# EAGLE design denziben (EAGLE 9.6.2)
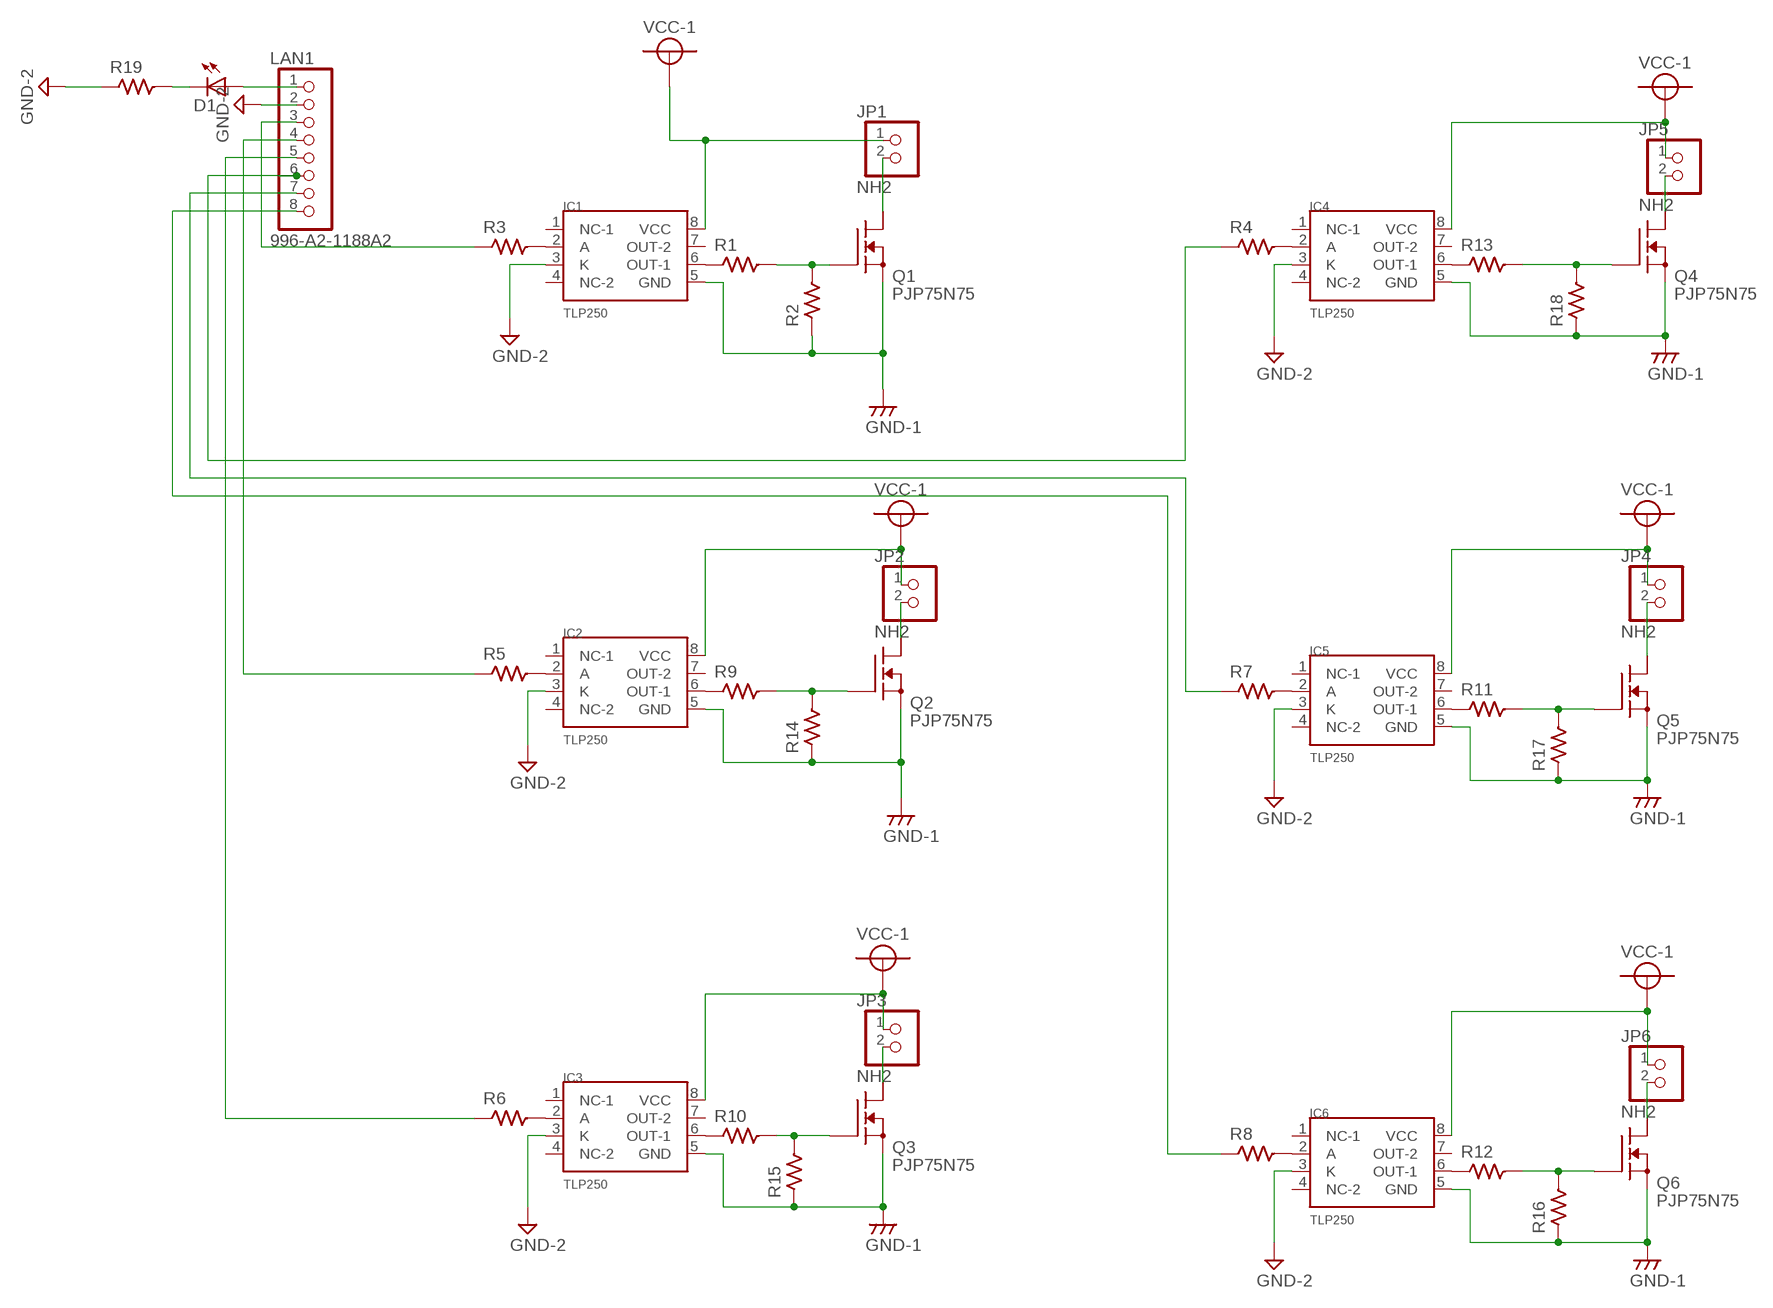
[diagram p0: schematic, sheet 1]

## Parts
D1  LED""  [LED5MM]
IC1  TLP250  [DIL8]
IC2  TLP250  [DIL8]
IC3  TLP250  [DIL8]
IC4  TLP250  [DIL8]
IC5  TLP250  [DIL8]
IC6  TLP250  [DIL8]
JP1  NH2  [NH2]
JP2  NH2  [NH2]
JP3  NH2  [NH2]
JP4  NH2  [NH2]
JP5  NH2  [NH2]
JP6  NH2  [NH2]
LAN1  996-A2-1188A2  [996-A2-1188A2]
Q1  PJP75N75  [TO220]
Q2  PJP75N75  [TO220]
Q3  PJP75N75  [TO220]
Q4  PJP75N75  [TO220]
Q5  PJP75N75  [TO220]
Q6  PJP75N75  [TO220]
R1  R1/4W  [R:1/4W]
R2  R1/4W  [R:1/4W]
R3  R1/4W  [R:1/4W]
R4  R1/4W  [R:1/4W]
R5  R1/4W  [R:1/4W]
R6  R1/4W  [R:1/4W]
R7  R1/4W  [R:1/4W]
R8  R1/4W  [R:1/4W]
R9  R1/4W  [R:1/4W]
R10  R1/4W  [R:1/4W]
R11  R1/4W  [R:1/4W]
R12  R1/4W  [R:1/4W]
R13  R1/4W  [R:1/4W]
R14  R1/4W  [R:1/4W]
R15  R1/4W  [R:1/4W]
R16  R1/4W  [R:1/4W]
R17  R1/4W  [R:1/4W]
R18  R1/4W  [R:1/4W]
R19  R1/4W  [R:1/4W]

## Nets
GND: IC1.5(GND) IC2.5(GND) IC3.5(GND) IC4.5(GND) IC5.5(GND) IC6.5(GND) Q1.3(NｃｈS) Q2.3(NｃｈS) Q3.3(NｃｈS) Q4.3(NｃｈS) Q5.3(NｃｈS) Q6.3(NｃｈS) R2.P$1 R14.P$1 R15.P$1 R16.P$1 R17.P$1 R18.P$1 ; supply symbol labelled GND-1
GND-2: IC1.3(K) IC2.3(K) IC3.3(K) IC4.3(K) IC5.3(K) IC6.3(K) LAN1.2 R19.P$1
N$1: JP1.2 Q1.2(NｃｈD)
N$2: Q1.1(Nｃｈ-G) R1.P$2 R2.P$2
N$3: IC4.2(A) R4.P$2
N$4: IC1.6(OUT-1) R1.P$1
N$5: IC2.2(A) R5.P$2
N$6: IC3.2(A) R6.P$2
N$7: IC1.2(A) R3.P$2
N$8: IC6.2(A) R8.P$2
N$9: IC2.6(OUT-1) R9.P$1
N$10: IC3.6(OUT-1) R10.P$1
N$11: IC5.6(OUT-1) R11.P$1
N$12: IC6.6(OUT-1) R12.P$1
N$13: IC4.6(OUT-1) R13.P$1
N$14: Q3.1(Nｃｈ-G) R10.P$2 R15.P$2
N$15: Q6.1(Nｃｈ-G) R12.P$2 R16.P$2
N$16: Q5.1(Nｃｈ-G) R11.P$2 R17.P$2
N$17: Q4.1(Nｃｈ-G) R13.P$2 R18.P$2
N$18: Q2.1(Nｃｈ-G) R9.P$2 R14.P$2
N$19: LAN1.3 R3.P$1
N$20: JP2.2 Q2.2(NｃｈD)
N$21: LAN1.4 R5.P$1
N$22: LAN1.5 R6.P$1
N$23: JP3.2 Q3.2(NｃｈD)
N$24: LAN1.6 R4.P$1
N$25: LAN1.7 R7.P$1
N$26: JP5.2 Q4.2(NｃｈD)
N$27: LAN1.8 R8.P$1
N$28: IC5.2(A) R7.P$2
N$29: JP4.2 Q5.2(NｃｈD)
N$30: JP6.2 Q6.2(NｃｈD)
N$31: D1.A LAN1.1
N$32: D1.K(C) R19.P$2
VCC-1: IC1.8(VCC) IC2.8(VCC) IC3.8(VCC) IC4.8(VCC) IC5.8(VCC) IC6.8(VCC) JP1.1 JP2.1 JP3.1 JP4.1 JP5.1 JP6.1
Unconnected: IC1.1(NC-1) IC1.4(NC-2) IC1.7(OUT-2) IC2.1(NC-1) IC2.4(NC-2) IC2.7(OUT-2) IC3.1(NC-1) IC3.4(NC-2) IC3.7(OUT-2) IC4.1(NC-1) IC4.4(NC-2) IC4.7(OUT-2) IC5.1(NC-1) IC5.4(NC-2) IC5.7(OUT-2) IC6.1(NC-1) IC6.4(NC-2) IC6.7(OUT-2)

## Library data of the parts
D1 = Robocon-Diode:LED
IC1-IC6 = Robocon-Photocoupler:TLP250
JP1-JP6 = Robocon-Connector:NH2
LAN1 = Robocon-Connector:996-A2-1188A2: LAN_Connectoｒ 996-A2-1188A2 Made by PINREX
Q1-Q6 = Robocon-Transistor:PJP75N75
R1-R19 = Robocon-RLC:R: Resistor

## Board
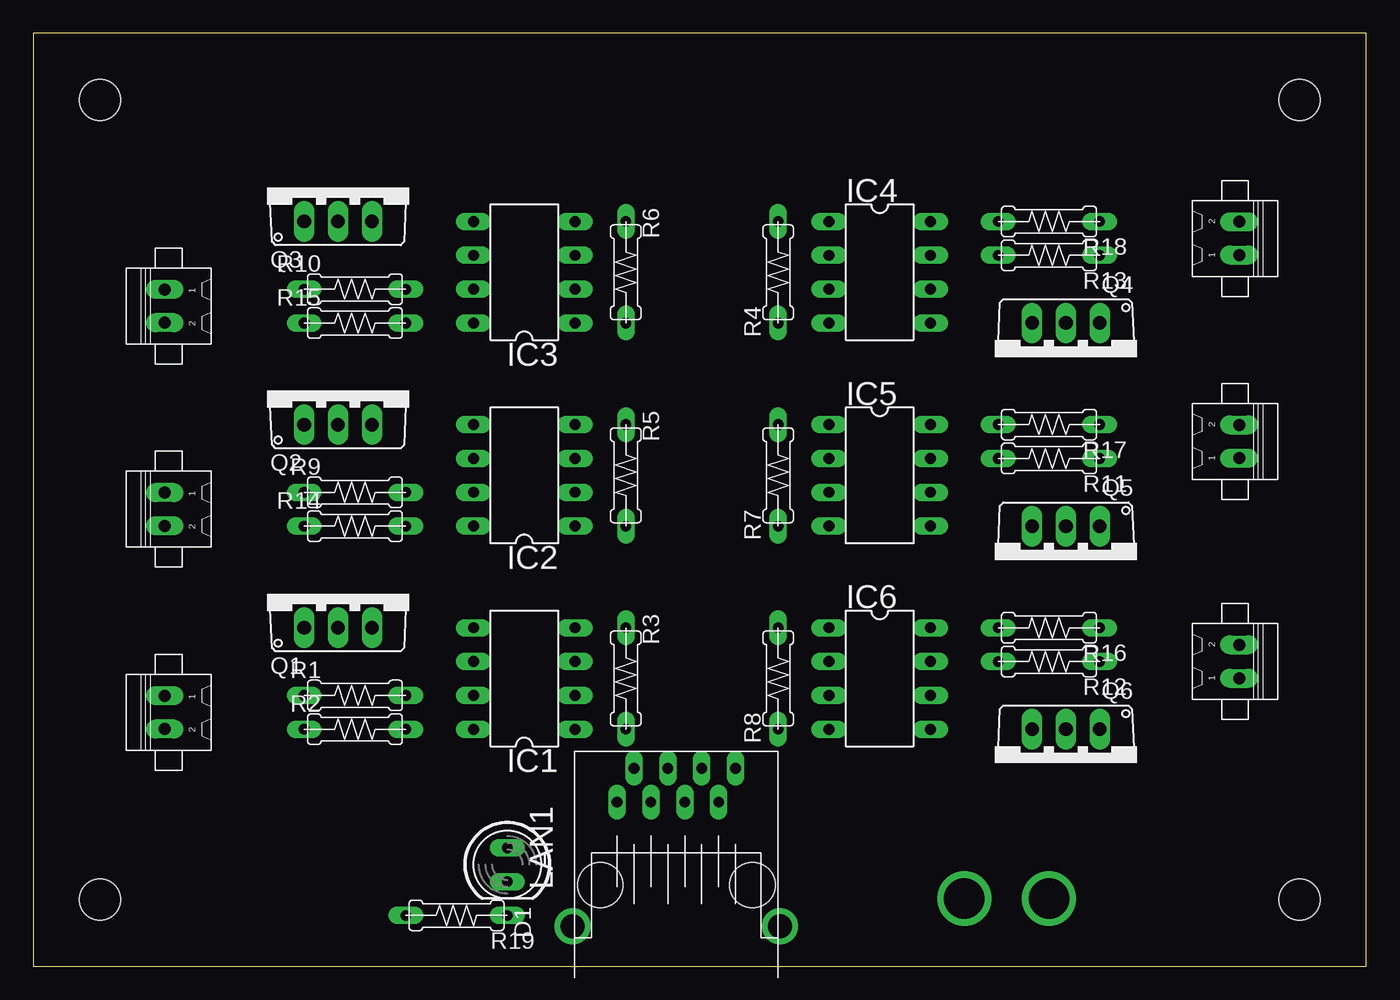
[diagram p1: board, top side]
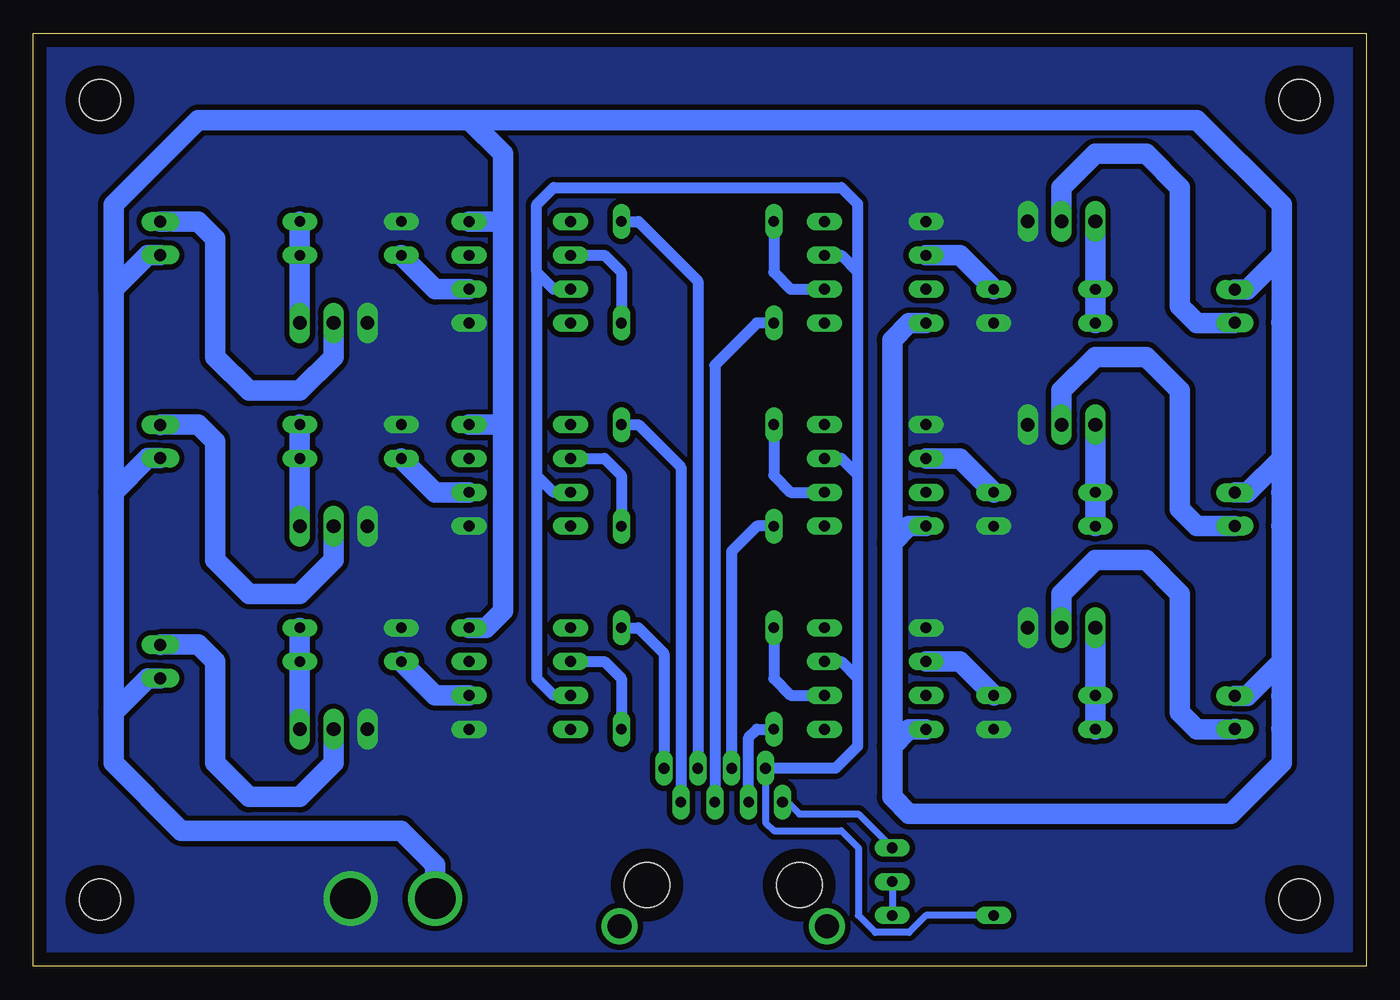
[diagram p2: board, bottom side, seen from below]

Size 100 x 70 mm. Coordinates in mm from the lower left corner, seen from the top.
Outline: 0,0 100,0 100,70 0,70 0,0
Copper layers (1*16): Top 0.035mm / dielectric 1.5mm / Bottom 0.035mm
Design rules "default": minimum track width 6mil, minimum drill 0.35mm, track to track 6mil, track to pad 6mil, pad to pad 6mil, via to via 6mil, smd to smd 6mil, copper to edge 40mil, drill to drill 6mil, minimum pad ring 10mil, minimum via ring 8mil, stop-mask expansion 4mil, vias tented up to drill 0mil, thermal gap 10mil
Holes 3.1 mm at 95,65 5,5 95,5 5,65

### Footprints (pad centres in the part's own frame; a part is rotated, then mirrored left to right if it is on the bottom)
LED5MM = drill 0.813 long: A -1.27,0; K 1.27,0
DIL8 = drill 0.813 long: 1 -3.81,-3.81; 2 -1.27,-3.81; 3 1.27,-3.81; 4 3.81,-3.81; 5 3.81,3.81; 6 1.27,3.81; 7 -1.27,3.81; 8 -3.81,3.81
NH2 = drill 0.9 long: 1 1.25,0.3; 2 -1.25,0.3
996-A2-1188A2 = drill 0.8 long: 1 -4.465,4.69; 2 -3.195,7.23; 3 -1.925,4.69; 4 -0.655,7.23; 5 0.615,4.69; 6 1.885,7.23; 7 3.155,4.69; 8 4.425,7.23 | drill 1.8: P$1 -7.795,-4.623; P$2 7.755,-4.623 | hole 3.4: -5.735,-1.533; 5.695,-1.533
TO220 = drill 1.016 long: 1 -2.54,-2.54; 2 0,-2.54; 3 2.54,-2.54
R:1/4W = drill 0.8 long: P$1 -3.81,0; P$2 3.81,0

### Placement (x,y rotation side)
D1  35.56,7.62 270 top
IC1  36.83,21.59 90 top
IC2  36.83,36.83 90 top
IC3  36.83,52.07 90 top
IC4  63.5,52.07 270 top
IC5  63.5,36.83 270 top
IC6  63.5,21.59 270 top
JP1  10.16,19.05 90 top
JP2  10.16,34.29 90 top
JP3  10.16,49.53 90 top
JP4  90.17,39.37 270 top
JP5  90.17,54.61 270 top
JP6  90.17,22.86 270 top
LAN1  48.26,7.62 0 top
Q1  22.86,27.94 0 top
Q2  22.86,43.18 0 top
Q3  22.86,58.42 0 top
Q4  77.47,45.72 180 top
Q5  77.47,30.48 180 top
Q6  77.47,15.24 180 top
R1  24.13,20.32 180 top
R2  24.13,17.78 180 top
R3  44.45,21.59 90 top
R4  55.88,52.07 270 top
R5  44.45,36.83 90 top
R6  44.45,52.07 90 top
R7  55.88,36.83 270 top
R8  55.88,21.59 270 top
R9  24.13,35.56 180 top
R10  24.13,50.8 180 top
R11  76.2,38.1 0 top
R12  76.2,22.86 0 top
R13  76.2,53.34 0 top
R14  24.13,33.02 180 top
R15  24.13,48.26 180 top
R16  76.2,25.4 0 top
R17  76.2,40.64 0 top
R18  76.2,55.88 0 top
R19  31.75,3.81 0 top

### Tracks (layer width: path | path; a pad name or v marks a point on that pad's centre or on a via)
GND  (via drill 3.05)
  other vias: 76.2,5.08
  pour Bottom (isolate 0.406, no thermals): 0,0 100,0 100,70 0,70
GND-2
  Bottom 0.508: LAN1.2 45.06,10.78 44.45,10.16 39.37,10.16 38.1,8.89 38.1,3.81 36.83,2.54 34.29,2.54 33.02,3.81 R19.P$1
  Bottom 0.61: LAN1.2 44.91,14.69
  Bottom 0.813: IC3.3 39.37,53.34 38.15,52.12 | 38.15,52.12 38.15,36.88 | IC2.3 39.37,38.1 38.15,36.88 | 38.15,36.88 38.15,21.64 | IC1.3 39.37,22.86 38.15,21.64 | 38.15,21.64 38.15,16.51 39.81,14.85 LAN1.2 45.01,14.79 | IC6.3 60.96,20.32 62.23,21.59 62.23,36.83 | IC5.3 60.96,35.56 62.23,36.83 | 62.23,52.07 62.23,36.83 | IC4.3 60.96,50.8 62.23,52.07 | 38.15,52.12 38.15,57.2 39.37,58.42 60.96,58.42 62.23,57.15 62.23,52.07
N$1
  Bottom 1.524: Q1.2 22.86,27.94 20.32,30.48 16.51,30.48 13.97,27.94 13.97,19.05 12.7,17.78 9.88,17.78 JP1.2
N$2
  Bottom 1.524: R2.P$2 R1.P$2 Q1.1
N$3
  Bottom 0.813: IC4.2 57.15,53.34 55.88,52.07 R4.P$2
N$4
  Bottom 1.524: R1.P$1 30.48,22.86 IC1.6
N$5
  Bottom 0.813: R5.P$2 44.45,36.83 43.18,35.56 IC2.2
N$6
  Bottom 0.813: R6.P$2 44.45,52.07 43.18,50.8 IC3.2
N$7
  Bottom 0.813: R3.P$2 44.45,21.59 43.18,20.32 IC1.2
N$8
  Bottom 0.813: IC6.2 57.15,22.86 55.88,21.59 R8.P$2
N$9
  Bottom 1.524: R9.P$1 30.48,38.1 IC2.6
N$10
  Bottom 1.524: R10.P$1 30.48,53.34 IC3.6
N$11
  Bottom 1.524: R11.P$1 69.85,35.56 IC5.6
N$12
  Bottom 1.524: R12.P$1 69.85,20.32 IC6.6
N$13
  Bottom 1.524: R13.P$1 69.85,50.8 IC4.6
N$14
  Bottom 1.524: R15.P$2 R10.P$2 Q3.1
N$15
  Bottom 1.524: R16.P$2 R12.P$2 Q6.1
N$16
  Bottom 1.524: R17.P$2 R11.P$2 Q5.1
N$17
  Bottom 1.524: R18.P$2 R13.P$2 Q4.1
N$18
  Bottom 1.524: R14.P$2 R9.P$2 Q2.1
N$19
  Bottom 0.813: LAN1.3 46.34,17.16 45.72,17.78 R3.P$1
N$20
  Bottom 1.524: Q2.2 22.86,43.18 20.32,45.72 16.51,45.72 13.97,43.18 13.97,34.29 12.7,33.02 9.88,33.02 JP2.2
N$21
  Bottom 0.813: R5.P$1 45.72,33.02 47.6,31.14 LAN1.4
N$22
  Bottom 0.813: R6.P$1 45.72,48.26 48.88,45.1 LAN1.5
N$23
  Bottom 1.524: Q3.2 22.86,58.42 20.32,60.96 16.51,60.96 13.97,58.42 13.97,49.53 12.7,48.26 9.88,48.26 JP3.2
N$24
  Bottom 0.813: R4.P$1 54.61,55.88 50.15,51.41 LAN1.6
N$25
  Bottom 0.813: R7.P$1 54.61,40.64 51.41,37.45 LAN1.7
N$26
  Bottom 1.524: Q4.2 77.47,45.72 80.01,43.18 83.82,43.18 86.36,45.72 86.36,54.61 87.63,55.88 90.45,55.88 JP5.2
N$27
  Bottom 0.813: R8.P$1 54.61,25.4 52.69,23.48 LAN1.8
N$28
  Bottom 0.813: IC5.2 57.15,38.1 55.88,36.83 R7.P$2
N$29
  Bottom 1.524: Q5.2 77.47,30.48 80.01,27.94 83.82,27.94 86.36,30.48 86.36,39.37 87.63,40.64 90.45,40.64 JP4.2
N$30
  Bottom 1.524: Q6.2 77.47,15.24 80.01,12.7 83.82,12.7 86.36,15.24 86.36,22.86 87.63,24.13 90.45,24.13 JP6.2
N$31
  Bottom 0.508: D1.A 38.1,11.43 42.52,11.43 43.4,12.31 LAN1.1
N$32
  Bottom 0.508: D1.K R19.P$2
VCC-1  (via drill 3.05)
  Bottom 1.524: IC3.8 34.29,48.26 35.56,46.99 35.56,31.75 | 35.56,31.75 35.56,16.51 | 35.56,16.51 35.56,12.7 34.29,11.43 10.16,11.43 6.35,15.24 6.35,17.78 | IC2.8 34.29,33.02 35.56,31.75 | IC1.8 34.29,17.78 35.56,16.51 | 6.35,17.78 6.35,20.32 | 6.35,20.32 6.35,22.86 | 6.35,22.86 6.35,33.02 | 6.35,33.02 6.35,35.56 | 6.35,35.56 6.35,38.1 | 6.35,38.1 6.35,48.26 | 67.31,63.5 12.7,63.5 6.35,57.15 6.35,53.34 | 67.31,63.5 64.77,60.96 64.77,55.88 | 93.98,50.8 93.98,35.56 | 93.98,35.56 93.98,19.05 | 93.98,19.05 93.98,15.24 88.9,10.16 72.39,10.16 69.85,7.62 v69.85,5.08 | 64.77,55.88 64.77,40.64 | 64.77,40.64 64.77,26.67 66.04,25.4 IC6.8 | IC5.8 64.77,40.64 | IC4.8 64.77,55.88 | 6.35,48.26 6.35,53.34 | 67.31,63.5 87.63,63.5 93.98,57.15 93.98,50.8 | 6.35,17.78 6.37,17.8 | 6.35,33.02 6.37,33.04 | 6.35,48.26 6.37,48.28 | 6.37,20.3 6.35,20.32 | 6.37,35.54 6.35,35.56 | JP3.1 8.91,50.78 6.35,53.34 | JP2.1 8.91,35.54 6.35,38.1 | JP1.1 8.91,20.3 6.35,22.86 | JP5.1 91.42,53.36 93.98,50.8 | JP4.1 91.42,38.12 93.98,35.56 | JP6.1 91.42,21.61 93.98,19.05